# Altium schematic sheet FPM_Connector.SchDoc
size A4
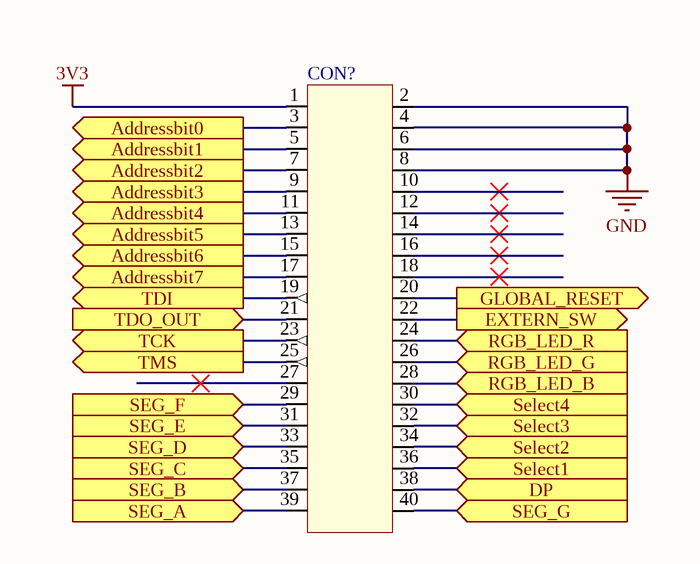
[diagram p0: FPM_Connector.SchDoc]

## Parts
CON?  CON_040_M_2MM54_S_A  [CON_040_THT_2MM54_S_A]  (value not drawn)

## Ports
Addressbit0 (out), Addressbit1 (out), Addressbit2 (out), Addressbit3 (out), Addressbit4 (out), Addressbit5 (out), Addressbit6 (out), Addressbit7 (out), DP (in), EXTERN_SW (out), GLOBAL_RESET (out), RGB_LED_B (in), RGB_LED_G (in), RGB_LED_R (in), SEG_A (in), SEG_B (in), SEG_C (in), SEG_D (in), SEG_E (in), SEG_F (in), SEG_G (in), Select1 (in), Select2 (in), Select3 (in), Select4 (in), TCK (out), TDI (out), TDO_OUT (in), TMS (out)

## Nets
3V3: CON?.1
GND: CON?.2 CON?.4 CON?.6 CON?.8
Addressbit0: CON?.3 ; port Addressbit0
Addressbit1: CON?.5 ; port Addressbit1
Addressbit2: CON?.7 ; port Addressbit2
Addressbit3: CON?.9 ; port Addressbit3
Addressbit4: CON?.11 ; port Addressbit4
Addressbit5: CON?.13 ; port Addressbit5
Addressbit6: CON?.15 ; port Addressbit6
Addressbit7: CON?.17 ; port Addressbit7
DP: CON?.38 ; port DP
EXTERN_SW: CON?.22 ; port EXTERN_SW
GLOBAL_RESET: CON?.20 ; port GLOBAL_RESET
RGB_LED_B: CON?.28 ; port RGB_LED_B
RGB_LED_G: CON?.26 ; port RGB_LED_G
RGB_LED_R: CON?.24 ; port RGB_LED_R
SEG_A: CON?.39 ; port SEG_A
SEG_B: CON?.37 ; port SEG_B
SEG_C: CON?.35 ; port SEG_C
SEG_D: CON?.33 ; port SEG_D
SEG_E: CON?.31 ; port SEG_E
SEG_F: CON?.29 ; port SEG_F
SEG_G: CON?.40 ; port SEG_G
Select1: CON?.36 ; port Select1
Select2: CON?.34 ; port Select2
Select3: CON?.32 ; port Select3
Select4: CON?.30 ; port Select4
TCK: CON?.23 ; port TCK
TDI: CON?.19 ; port TDI
TDO_OUT: CON?.21 ; port TDO_OUT
TMS: CON?.25 ; port TMS

Not connected (* = marked no-connect by the designer): CON? 10* 12* 14* 16* 18* 27*

## Library data of the parts
CON? = X_00006869: Connector Header Through Hole 40 position 2.54mm; manufacturer: On Shore Technology Inc.; manufacturer_partnumber: 302-S401; Parameter 3: Digi-Key ED10529-ND; entity_name: CON_040_M_2MM54_S_A_CON HEADER 40 POS; release: blocked; max_operating_temp: 105C; min_operating_temp: -40C; grid: 2MM54; pin_count_type: A; mounting_type: S; gender: M; number_of_electronic_pins: 040; ordering_information_btm: ED10529-ND; used_in_bom: 0; production_status: Aktiv; editor_date: niemiec_14.05.2020; x2e_number: X_00006869; entity_type_name: connector; height: 8mm80; width: 9mm05; length: 58mm4; package: THT; shell_material: Polyester, Glass Filled; features: Connector Header Through Hole 40 position 0.100" (2.54mm); series: 302